# Altium schematic sheet HV_DRV.SchDoc
size A4
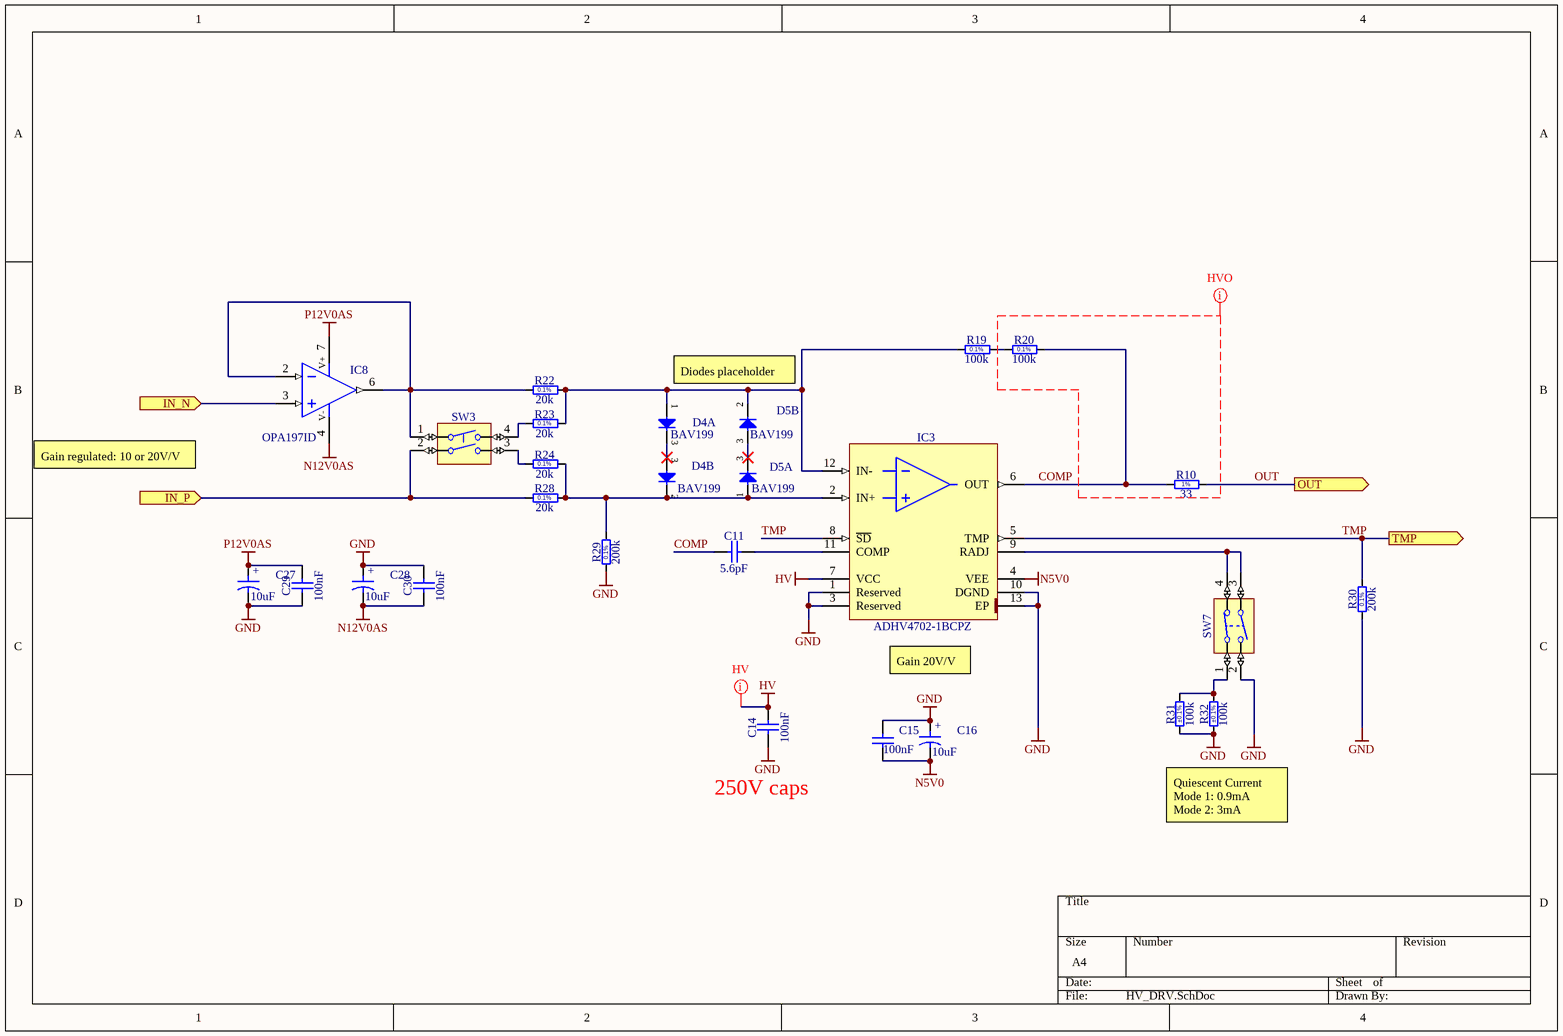
[diagram p0: HV_DRV.SchDoc]

## Parts
C11  5.6pF  [CAPC3216X140N]
C14  100nF  [CAPC4720X215N]
C15  100nF  [CAPC1005X55N]
C16  10uF  [CAPMP3216X180N]
C27  10uF  [CAPMP3216X180N]
C28  10uF  [CAPMP3216X180N]
C29  100nF  [CAPC1608X87N]
C30  100nF  [CAPC1608X87N]
D4  BAV199  [SOT95P240X110-3N]  (parts A,B of 2)
D5  BAV199  [SOT95P240X110-3N]  (parts A,B of 2)
IC3  ADHV4702-1BCPZ  [QFN170P700X700X80-13N-S290]
IC8  OPA197ID  [SOIC127P600X175-8N]
R10  33  [RESC2012X60N]
R19  100k  [RESC2012X60N]
R20  100k  [RESC2012X60N]
R22  20k  [RESC1608X55N]
R23  20k  [RESC1608X55N]
R24  20k  [RESC1608X55N]
R28  20k  [RESC1608X55N]
R29  200k  [RESC1608X55N]
R30  200k  [RESC1608X55N]
R31  100k  Tolerance: ±0.1%  [RESC1005X35N]
R32  100k  Tolerance: ±0.1%  [RESC1005X35N]
SW3  Switch  [SW_ERG_SDD-1-023]  (value not drawn)
SW7  Switch  [SW_CTS_204-121ST]  (value not drawn)

## Ports
IN_N (in), IN_P (in), OUT (out), TMP (out)

## Nets
GND: C14.1 C15.2 C16.1 C27.2 C28.1 C29.1 C30.2 IC3.1(Reserved) IC3.3(Reserved) IC3.10(DGND) IC3.13(EP) R29.1 R30.1 R31.1 R32.1 SW7.2
HV: C14.2 IC3.7(VCC)
N5V0: C15.1 C16.2 IC3.4(VEE)
N12V0AS: C28.2 C30.1 IC8.4(V-)
P12V0AS: C27.1 C29.2 IC8.7(V+)
COMP: C11.1 IC3.6(OUT) R10.1 R20.2
IN_N: IC8.3(IN+) ; port IN_N
IN_P: R28.1 SW3.2 ; port IN_P
OUT: R10.2 ; port OUT
TMP: IC3.5(TMP) IC3.8(~{SD}) R30.2 ; port TMP
NetC11_2: C11.2 IC3.11(COMP)
NetD4_1: D4.1(A) D5.2(C) IC3.12(IN-) R19.1 R22.2 R23.2
NetD4_2: D4.2(C) D5.1(A) IC3.2(IN+) R24.2 R28.2 R29.2
NetIC3_9: IC3.9(RADJ) SW7.3 SW7.4
NetIC8_2: IC8.2(IN-) IC8.6(OUT) R22.1 SW3.1
NetR19_2: R19.2 R20.1
NetR23_1: R23.1 SW3.4
NetR24_1: R24.1 SW3.3
NetR31_2: R31.2 R32.2 SW7.1

Not connected (* = marked no-connect by the designer): D4 3(COMAC)*; D5 3(COMAC)*

## Layout directives
net class HV: HV
net class HVO: COMP

## Notes on the sheet
- Diodes placeholder
  Text
- Gain regulated: 10 or 20V/V
- Gain 20V/V
- Quiescent Current
  Mode 1: 0.9mA
  Mode 2: 3mA
- Labels drawn without touching a wire or pin: 250V caps
- (in symbol CTE3216-18_10UF_16V_20%_AVX_TCJ) +
- (in symbol R0603_20K_0.1%_0.063W_10PPM) 0.1%
- (in symbol R0603_200K_0.1%_0.063W_10PPM) 0.1%
- (in symbol R0805_33R_1%_0.125W_100PPM) 1%
- (in symbol R0805_100K_0.1%_0.1W_10PPM) 0.1%

## Library data of the parts
C11 = CC1206_5.6PF_50V_0.25PF_NP0: Non-polarised capacitor; Part Description: SMD Multilayer Chip Ceramic Capacitor; Manufacturer: GENERIC; Manufacturer1 Part Number: VJ1206A5R6CXAAT; Voltage: 50V; TC: C0G/NP0; Tolerance: ±0.25pF; Part Number: CC1206_5.6PF_50V_0.25PF_NP0; Component Kind: Standard; Component Type: Standard; Pin Count: 2; Value: 5.6pF; Status: Preferred; Manufacturer Part Number: CC1206_5.6PF_50V_0.25PF_NP0; Case: 1206; Mounted: Yes; Socket: No; SMD: Yes; Sense: No; Manufacturer1 Example: VISHAY VITRAMON; Manufacturer1 ComponentHeight: 1.7mm; HelpURL: \\cern.ch\dfs\Applications\Altium\Datasheets\CC1206_NP0_VISHAY_VJ.pdf; Author: CERN DEM JLC; CreateDate: 03.12.2007; LatestRevisionDate: 03.12.2007
C14 = CC1808_100NF_630V_10%_X7R: Non-polarised capacitor; Part Description: SMD Multilayer Chip Ceramic Capacitor; Manufacturer: GENERIC; Manufacturer1 Part Number: C1808C104KBRAC; Voltage: 630V; TC: X7R; Tolerance: ±10%; Part Number: CC1808_100NF_630V_10%_X7R; Component Kind: Standard; Component Type: Standard; Pin Count: 2; Value: 100nF; Status: None; Manufacturer Part Number: CC1808_100NF_630V_10%_X7R; Case: 1808; Mounted: Yes; Socket: No; SMD: Yes; Sense: No; Manufacturer1 Example: KEMET; Manufacturer1 ComponentHeight: 2.15mm; HelpURL: \\cern.ch\dfs\Applications\Altium\Datasheets\CC1808_X7R_KEMET-HV.pdf; Author: CERN DEM MR; CreateDate: 23.11.2016; LatestRevisionDate: 23.11.2016
C15 = CC0402_100NF_16V_10%_X5R: Non-polarised capacitor; Part Description: SMD Multilayer Chip Ceramic Capacitor; Manufacturer: GENERIC; Manufacturer1 Part Number: GRM155R61C104KA88D; Voltage: 16V; TC: X5R; Tolerance: ±10%; Part Number: CC0402_100NF_16V_10%_X5R; Component Kind: Standard; Component Type: Standard; Pin Count: 2; Value: 100nF; Status: None; Manufacturer Part Number: CC0402_100NF_16V_10%_X5R; Case: 0402; Mounted: Yes; Socket: No; SMD: Yes; Sense: No; Manufacturer1 Example: MURATA; Manufacturer1 ComponentHeight: 0.55mm; HelpURL: \\cern.ch\dfs\Applications\Altium\Datasheets\CC0402_X5R_MURATA_GRM.pdf; Author: CERN DEM JLC; CreateDate: 10.12.2013; LatestRevisionDate: 10.12.2013
C16 C27 C28 = CTE3216-18_10UF_16V_20%_AVX_TCJ: Polarised capacitor; Part Description: ESR 0R200 Tantalum Solid Electrolytic Chip Capacitor with Conductive Polymer Electrode; Manufacturer: AVX; Manufacturer Part Number: TCJA106M016R0200; Voltage: 16V; Tolerance: ±20%; Part Number: CTE3216-18_10UF_16V_20%_AVX_TCJ; Component Kind: Standard; Component Type: Standard; Pin Count: 2; Value: 10uF; Status: Preferred; Case: A; Mounted: Yes; Socket: No; SMD: Yes; Sense: No; ComponentHeight: 1.8mm; HelpURL: \\cern.ch\dfs\Applications\Altium\Datasheets\CTE_AVX_TCJ.pdf; Author: CERN DEM JLC; CreateDate: 29.03.2012; LatestRevisionDate: 29.03.2012
C29 C30 = CC0603_100NF_50V_10%_X7R: Non-polarised capacitor; Part Description: SMD Multilayer Chip Ceramic Capacitor; Manufacturer: GENERIC; Manufacturer1 Part Number: 223858615649; Voltage: 50V; TC: X7R; Tolerance: ±10%; Part Number: CC0603_100NF_50V_10%_X7R; Component Kind: Standard; Component Type: Standard; Pin Count: 2; Value: 100nF; Status: Preferred; Manufacturer Part Number: CC0603_100NF_50V_10%_X7R; Case: 0603; Mounted: Yes; Socket: No; SMD: Yes; Sense: No; Manufacturer1 Example: PHYCOMP; Manufacturer1 ComponentHeight: 0.87mm; HelpURL: \\cern.ch\dfs\Applications\Altium\Datasheets\CC0603_X7R_PHYCOMP.pdf; Author: CERN DEM JLC; CreateDate: 03/12/2007; LatestRevisionDate: 03/12/2007
D4 D5 = BAV199: Serial Diode; Part Description: Low-Leakage Double Diode; Manufacturer: NXP SEMICONDUCTORS; Voltage: 75V; Power: 250mW; PressFit: No; Bonding: No; Part Number: BAV199; Component Kind: Standard; Component Type: Standard; Device: BAV199; PackageDescription: SOT23 3-Leads, Pitch 0.95mm - Body 1.4x3mm, IPC Medium Density; Manufacturer Part Number: BAV199; Pin Count: 3; Case: SOT23-3; Mounted: Yes; Socket: No; SMD: Yes; Sense: No; ComponentHeight: 1.1mm; HelpURL: \\cern.ch\dfs\Applications\Altium\Datasheets\BAV199.pdf; Author: CERN DEM JMW; CreateDate: 21.11.2008; LatestRevisionDate: 21.11.2008
IC3 = ADHV4702-1BCPZ: 24V to 220V Precision Operational Amplifier; Manufacturer: ANALOG DEVICES; PressFit: No; Bonding: No; Part Number: ADHV4702-1BCPZ; Component Kind: Standard; Component Type: Standard; Device: ADHV4702-1BCPZ; PackageDescription: QFN, 1.70mm Pitch, Square; 12 pin, 7.00mm L X 7.00mm W X 0.80mm H body (w/Thermal Tab 2.9 X 2.9mm), IPC Medium Density; Part Description: 24V to 220V Precision Operational Amplifier; Manufacturer Part Number: ADHV4702-1BCPZ; Pin Count: 13; Case: QFN12; Mounted: Yes; Socket: No; SMD: Yes; Sense: No; ComponentHeight: 0.8mm; Author: CERN DEM BC; HelpURL: \\cern.ch\dfs\Applications\Altium\Datasheets\ADHV4702-1BCPZ.pdf; CreateDate: 29.08.2019; LatestRevisionDate: 29.08.2019
IC8 = OPA197ID: Operational Amplifier; Part Description: 36-V, Precision, Rail-to-Rail Input/Output, Low Offset Voltage, Operational Amplifiers; Manufacturer: TEXAS INSTRUMENTS; PressFit: No; Bonding: No; Part Number: OPA197ID; Component Kind: Standard; Component Type: Standard; Device: OPA197ID; PackageDescription: SOIC 8, Pitch 1.27mm - Body 4x5mm, IPC Medium Density; Manufacturer Part Number: OPA197ID; Pin Count: 8; Case: SOIC8; Mounted: Yes; Socket: No; SMD: Yes; Sense: No; ComponentHeight: 1.75mm; Author: CERN DEM MR; HelpURL: \\cern.ch\dfs\Applications\Altium\Datasheets\OPA197ID.pdf; CreateDate: 30/06/2017; LatestRevisionDate: 30/06/2017
R10 = R0805_33R_1%_0.125W_100PPM: Resistor - 1%; Part Description: General Purpose Thick Film Chip Resistor; Manufacturer: GENERIC; Manufacturer1 Part Number: NRC10F33R0TRF; Power: 0.125W; TC: ±100ppm/°C; PressFit: No; Part Number: R0805_33R_1%_0.125W_100PPM; Component Kind: Standard; Component Type: Standard; Pin Count: 2; Value: 33; Status: Preferred; Tolerance: ±1%; Manufacturer Part Number: R0805_33R_1%_0.125W_100PPM; Case: 0805; Mounted: Yes; Sense: No; Socket: No; SMD: Yes; Manufacturer1 Example: NIC COMPONENT; Manufacturer1 ComponentHeight: 0.6mm; HelpURL: \\cern.ch\dfs\Applications\Altium\Datasheets\R0805_NIC_NRC.pdf; Author: CERN DEM JLC; CreateDate: 03.12.2007; LatestRevisionDate: 13.03.2008
R19 R20 = R0805_100K_0.1%_0.1W_10PPM: Resistor - 0.1%; Part Description: Thin Film Chip Resistor; Manufacturer: GENERIC; Manufacturer1 Part Number: RN73C2A100KBTG; Power: 0.1W; TC: ±10ppm; PressFit: No; Part Number: R0805_100K_0.1%_0.1W_10PPM; Component Kind: Standard; Component Type: Standard; Pin Count: 2; Value: 100k; Status: Not Recommended; Tolerance: ±0.1%; Manufacturer Part Number: R0805_100K_0.1%_0.1W_10PPM; Case: 0805; Mounted: Yes; Sense: No; Socket: No; SMD: Yes; Manufacturer1 Example: TYCO HOLSWORTHY; Manufacturer1 ComponentHeight: 0.6mm; HelpURL: \\cern.ch\dfs\Applications\Altium\Datasheets\R0805_Tyco_RN73.pdf; Author: CERN DEM JLC; CreateDate: 03.12.2007; LatestRevisionDate: 13.03.2008
R22-R24 R28 = R0603_20K_0.1%_0.063W_10PPM: Resistor - 0.1%; Part Description: Thin Film Chip Resistor; Manufacturer: GENERIC; Manufacturer1 Part Number: RN73C1J20KBTDF; Power: 0.063W; TC: ±10ppm; PressFit: No; Part Number: R0603_20K_0.1%_0.063W_10PPM; Component Kind: Standard; Component Type: Standard; Pin Count: 2; Value: 20k; Status: Not Recommended; Tolerance: ±0.1%; Manufacturer Part Number: R0603_20K_0.1%_0.063W_10PPM; Case: 0603; Mounted: Yes; Sense: No; Socket: No; SMD: Yes; Manufacturer1 Example: TYCO HOLSWORTHY; Manufacturer1 ComponentHeight: 0.5mm; HelpURL: \\cern.ch\dfs\Applications\Altium\Datasheets\R0603_Tyco_RN73.pdf; Author: CERN DEM JLC; CreateDate: 03.12.2007; LatestRevisionDate: 13.03.2008
R29 R30 = R0603_200K_0.1%_0.063W_10PPM: Resistor - 0.1%; Part Description: Thin Film Chip Resistor; Manufacturer: GENERIC; Manufacturer1 Part Number: RN73C1J200KBTDF; Power: 0.063W; TC: ±10ppm; PressFit: No; Part Number: R0603_200K_0.1%_0.063W_10PPM; Component Kind: Standard; Component Type: Standard; Pin Count: 2; Value: 200k; Status: Not Recommended; Tolerance: ±0.1%; Manufacturer Part Number: R0603_200K_0.1%_0.063W_10PPM; Case: 0603; Mounted: Yes; Sense: No; Socket: No; SMD: Yes; Manufacturer1 Example: TYCO HOLSWORTHY; Manufacturer1 ComponentHeight: 0.5mm; HelpURL: \\cern.ch\dfs\Applications\Altium\Datasheets\R0603_Tyco_RN73.pdf; Author: CERN DEM MR; CreateDate: 12.10.2017; LatestRevisionDate: 12.10.2017
R31 R32 = R0402_100K_0.1%_0.063W_25PPM: Resistor - 0.1%; Part Description: Thin Film Precision Resistor; Manufacturer: GENERIC; Manufacturer1 Part Number: CPF0402B100KE1; Power: 0.063W; TC: ±25ppm/°C; PressFit: No; Part Number: R0402_100K_0.1%_0.063W_25PPM; Component Kind: Standard; Component Type: Standard; Pin Count: 2; Value: 100k; Status: Not Recommended; Manufacturer Part Number: R0402_100K_0.1%_0.063W_25PPM; Case: 0402; Mounted: Yes; Sense: No; Socket: No; SMD: Yes; Manufacturer1 Example: TE CONNECTIVITY; Manufacturer1 ComponentHeight: 0.35mm; HelpURL: \\cern.ch\dfs\Applications\Altium\Datasheets\R0402_TYCO_CPF.pdf; Author: CERN DEM JMW; CreateDate: 22.09.2015; LatestRevisionDate: 22.09.2015
SW3 = SW_ERG_SDD-1-023: DPST DIP Switch; Part Description: SpectraDIL Ganged ON/OFF DPST DIP Switch, SDD 023 Series; Manufacturer: ITW ERG; PressFit: No; Part Number: SW_ERG_SDD-1-023; Component Kind: Standard; Component Type: Standard; Pin Count: 4; PackageDescription: ERG SpectraDIL Ganged ON/OFF DPST DIP Switch, Body 6.7x10.5mm, Pitch 2.54mm, SDD 023 Series; Family: Switch; Mounted: Yes; Socket: No; SMD: No; Sense: No; Status: None; Manufacturer Part Number: SDD-1-023; ComponentHeight: 9mm; HelpURL: \\cern.ch\dfs\Applications\Altium\Datasheets\SW_ERG_SDD-1-023.pdf; Author: CERN DEM JLC; CreateDate: 24.10.2017; LatestRevisionDate: 24.10.2017
SW7 = SW_CTS_204-121ST: 2x SPST DIP Switch 1NO + 1NF; Part Description: Single SPDT DIP Switch, (1NO + 1NF Coupled), CTS 204 Series; Manufacturer: CTS; PressFit: No; Part Number: SW_CTS_204-121ST; Component Kind: Standard; Component Type: Standard; Pin Count: 4; PackageDescription: Body 7.26 x 9.78mm, 2x SPST DIP, 1NO + 1NF Switch, CTS 204 Series; Family: Switch; Mounted: Yes; Socket: No; SMD: Yes; Sense: No; Status: None; Manufacturer Part Number: 204-121ST; ComponentHeight: 10.36mm; HelpURL: \\cern.ch\dfs\Applications\Altium\Datasheets\SW_CTS_204-121ST.pdf; Author: CERN DEM JLC; CreateDate: 28.08.2014; LatestRevisionDate: 28.08.2014